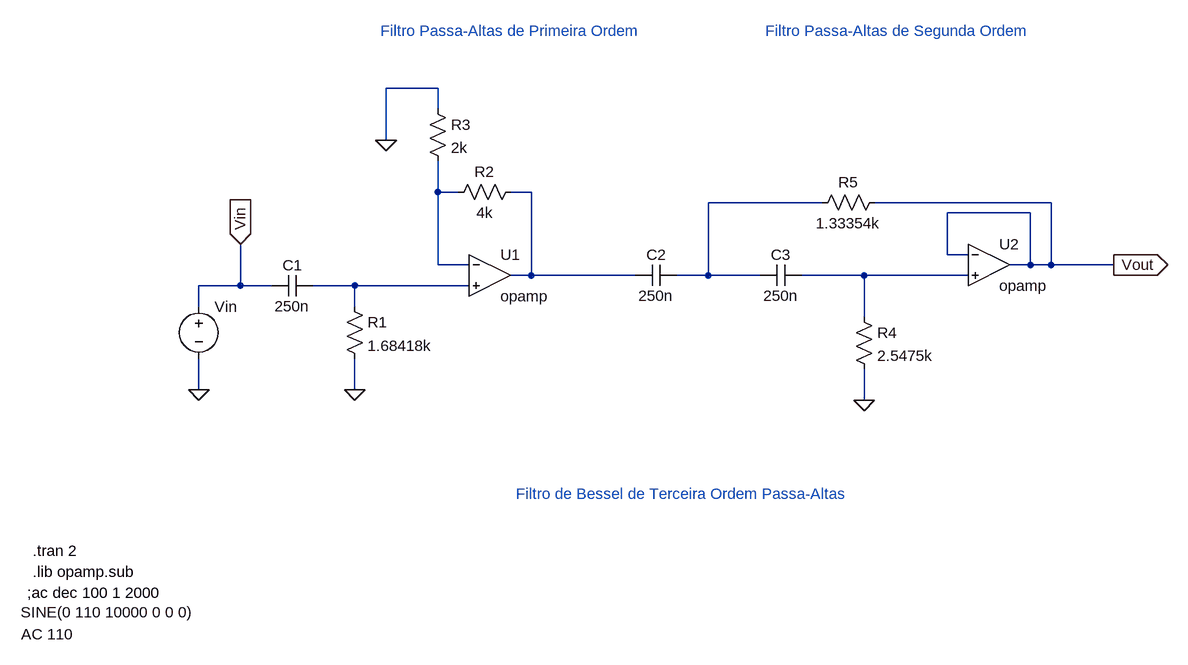
[diagram p0: schematic filtrobessel.asc]
filtrobessel.asc, the LTspice schematic file:
Version 4
SHEET 1 1552 776
WIRE 160 -80 80 -80
WIRE 160 -48 160 -80
WIRE 80 0 80 -80
WIRE 160 80 160 32
WIRE 192 80 160 80
WIRE 304 80 272 80
WIRE 752 96 576 96
WIRE 1104 96 832 96
WIRE 1072 112 944 112
WIRE 944 176 944 112
WIRE 976 176 944 176
WIRE 160 192 160 80
WIRE 208 192 160 192
WIRE 1072 192 1072 112
WIRE 1072 192 1040 192
WIRE 1104 192 1104 96
WIRE 1104 192 1072 192
WIRE 1200 192 1104 192
WIRE 304 208 304 80
WIRE 304 208 272 208
WIRE 464 208 304 208
WIRE 576 208 576 96
WIRE 576 208 528 208
WIRE 656 208 576 208
WIRE 816 208 720 208
WIRE 976 208 816 208
WIRE -144 224 -144 160
WIRE -144 224 -208 224
WIRE -96 224 -144 224
WIRE 32 224 -32 224
WIRE 208 224 32 224
WIRE -208 256 -208 224
WIRE 32 256 32 224
WIRE 816 272 816 208
WIRE -208 384 -208 336
WIRE 32 384 32 336
WIRE 816 400 816 352
FLAG 32 384 0
FLAG 816 400 0
FLAG -144 160 Vin
IOPIN -144 160 In
FLAG -208 384 0
FLAG 1200 192 Vout
IOPIN 1200 192 Out
FLAG 80 0 0
SYMBOL res 16 240 R0
SYMATTR InstName R1
SYMATTR Value 1.68418k
SYMBOL cap -32 208 R90
WINDOW 0 0 32 VBottom 2
WINDOW 3 32 32 VTop 2
SYMATTR InstName C1
SYMATTR Value 250n
SYMBOL cap 528 192 R90
WINDOW 0 0 32 VBottom 2
WINDOW 3 32 32 VTop 2
SYMATTR InstName C2
SYMATTR Value 250n
SYMBOL cap 720 192 R90
WINDOW 0 0 32 VBottom 2
WINDOW 3 32 32 VTop 2
SYMATTR InstName C3
SYMATTR Value 250n
SYMBOL res 800 256 R0
SYMATTR InstName R4
SYMATTR Value 2.5475k
SYMBOL res 848 80 R90
WINDOW 0 0 56 VBottom 2
WINDOW 3 32 56 VTop 2
SYMATTR InstName R5
SYMATTR Value 1.33354k
SYMBOL voltage -208 240 R0
WINDOW 123 -273 520 Left 2
WINDOW 39 0 0 Left 0
WINDOW 3 -274 486 Left 2
SYMATTR Value2 AC 110
SYMATTR Value SINE(0 110 10000 0 0 0)
SYMATTR InstName Vin
SYMBOL OpAmps\\opamp 240 144 R0
SYMATTR InstName U1
SYMBOL OpAmps\\opamp 1008 128 R0
SYMATTR InstName U2
SYMBOL res 144 -64 R0
SYMATTR InstName R3
SYMATTR Value 2k
SYMBOL res 288 64 R90
WINDOW 0 0 56 VBottom 2
WINDOW 3 32 56 VTop 2
SYMATTR InstName R2
SYMATTR Value 4k
TEXT 664 -168 Left 2 ;Filtro Passa-Altas de Segunda Ordem
TEXT 72 -168 Left 2 ;Filtro Passa-Altas de Primeira Ordem
TEXT 280 544 Left 2 ;Filtro de Bessel de Terceira Ordem Passa-Altas
TEXT -464 664 Left 2 !.lib opamp.sub
TEXT -472 696 Left 2 !;ac dec 100 1 2000
TEXT -464 632 Left 2 !.tran 2

The netlist it stands for:
* filtrobessel.asc
R1 N005 0 1.68418k
C1 N005 Vin 250n
C2 N003 N002 250n
C3 N004 N003 250n
R4 N004 0 2.5475k
R5 Vout N003 1.33354k
Vin Vin 0 SINE(0 110 10000 0 0 0) AC 110
XU1 N001 N005 N002 opamp Aol=100K GBW=10Meg  ; pins invin noninvin out
XU2 Vout N004 Vout opamp Aol=100K GBW=10Meg  ; pins invin noninvin out
R3 0 N001 2k
R2 N002 N001 4k
* Filtro Passa-Altas de Segunda Ordem
* Filtro Passa-Altas de Primeira Ordem
* Filtro de Bessel de Terceira Ordem Passa-Altas
.lib opamp.sub
;ac dec 100 1 2000
.tran 2
.backanno
.end